# Altium schematic sheet FPC_P8_P0.5mm_SMD.schdoc
size 124 x 99 mm
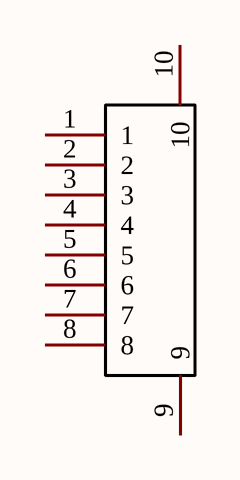
[diagram p0: FPC_P8_P0.5mm_SMD.schdoc]

## Parts
FPC?  AFC01-S08FCA-00  [FPC-SMD_P0.50-8P_FGS-XJ-H2.0]  (value not drawn)

## Nets

Not connected (* = marked no-connect by the designer): FPC? 1 2 3 4 5 6 7 8 9 10

## Library data of the parts
FPC? = AFC01-S08FCA-00: Manufacturer: JS(钜硕电子); Add into BOM: yes; Locking Feature: 翻盖式; Number of Contacts: 8P; Pitch: 0.5mm; FFC, FCB Thickness: 0.3mm; Symbol: AFC01-S08FCA-00; Device: AFC01-S08FCA-00; Supplier: LCSC; Supplier Part: C262657; Manufacturer Part: AFC01-S08FCA-00; JLCPCB Part Class: Extended Part; LCSC Part Name: 间距:0.5mm P数:8P 翻盖式 下接; Supplier Footprint: SMD,P=0.5mm,卧贴; Datasheet: https://atta.szlcsc.com/upload/public/pdf/source/20190816/C413942_2A72D1AC756EAE17EEDF756A339D4500.pdf; Convert to PCB: yes; Contact Type: 下接; Mounting Type: 卧贴; Height Above Board: 2mm